# EAGLE schematic template (EAGLE 6.4)
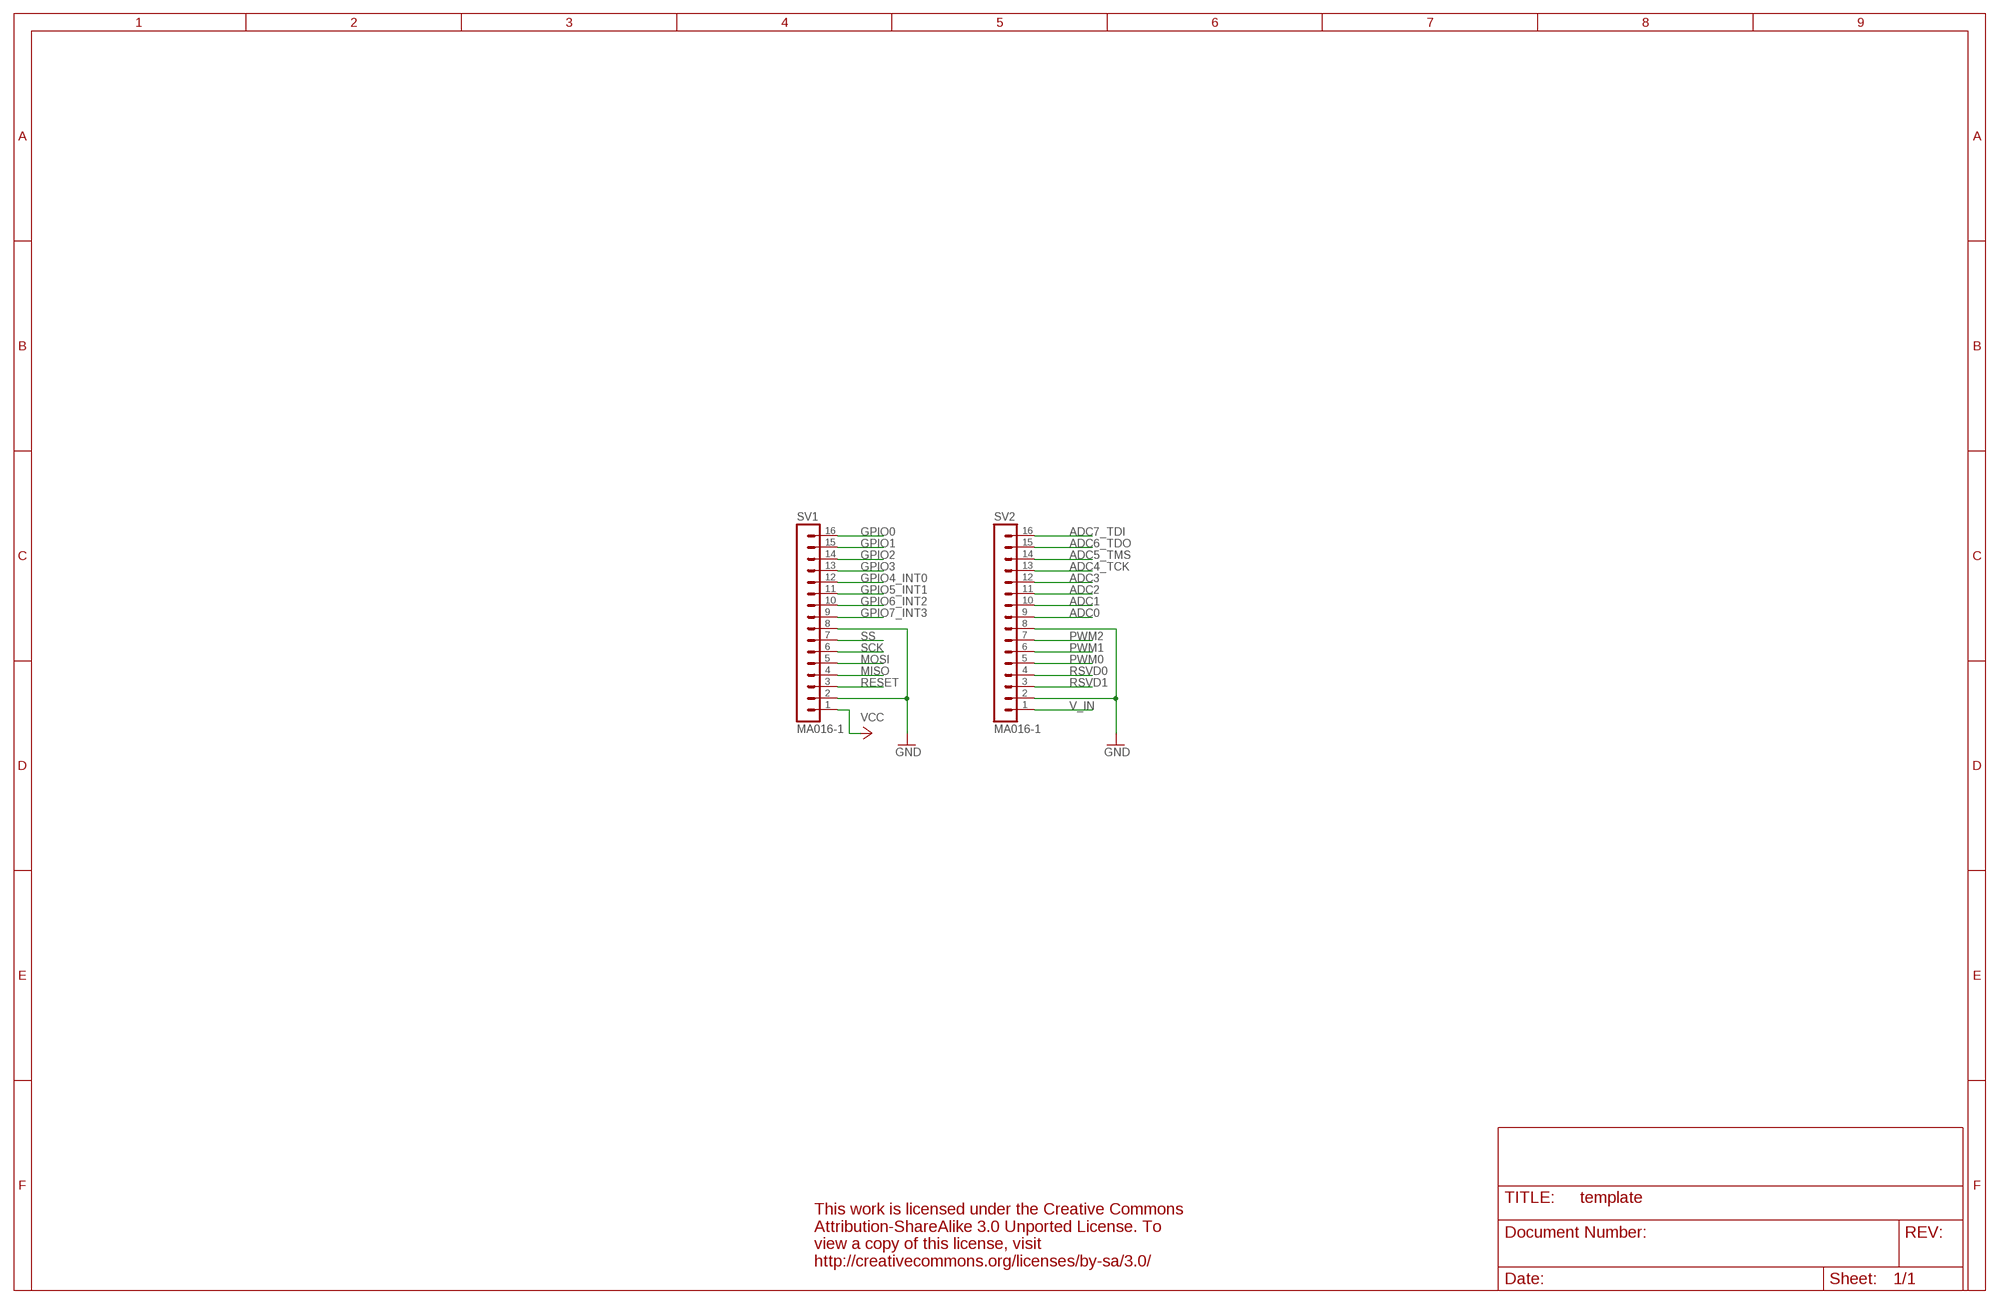
[diagram p0: schematic, sheet 1]

## Parts
SV1  MA016-1  [MA016-1]
SV2  MA016-1  [MA016-1]

## Nets
ADC0: SV2.9
ADC1: SV2.10
ADC2: SV2.11
ADC3: SV2.12
ADC4_TCK: SV2.13
ADC5_TMS: SV2.14
ADC6_TDO: SV2.15
ADC7_TDI: SV2.16
GND: SV1.2 SV1.8 SV2.2 SV2.8
GPIO0: SV1.16
GPIO1: SV1.15
GPIO2: SV1.14
GPIO3: SV1.13
GPIO4_INT0: SV1.12
GPIO5_INT1: SV1.11
GPIO6_INT2: SV1.10
GPIO7_INT3: SV1.9
MISO: SV1.4
MOSI: SV1.5
PWM0: SV2.5
PWM1: SV2.6
PWM2: SV2.7
RESET: SV1.3
RSVD0: SV2.4
RSVD1: SV2.3
SCK: SV1.6
SS: SV1.7
V_IN: SV2.1
VCC: SV1.1

## Library data of the parts
SV1 SV2 = sapphire:MA016-1